# EAGLE design bits3.2 (EAGLE 9.2.2)
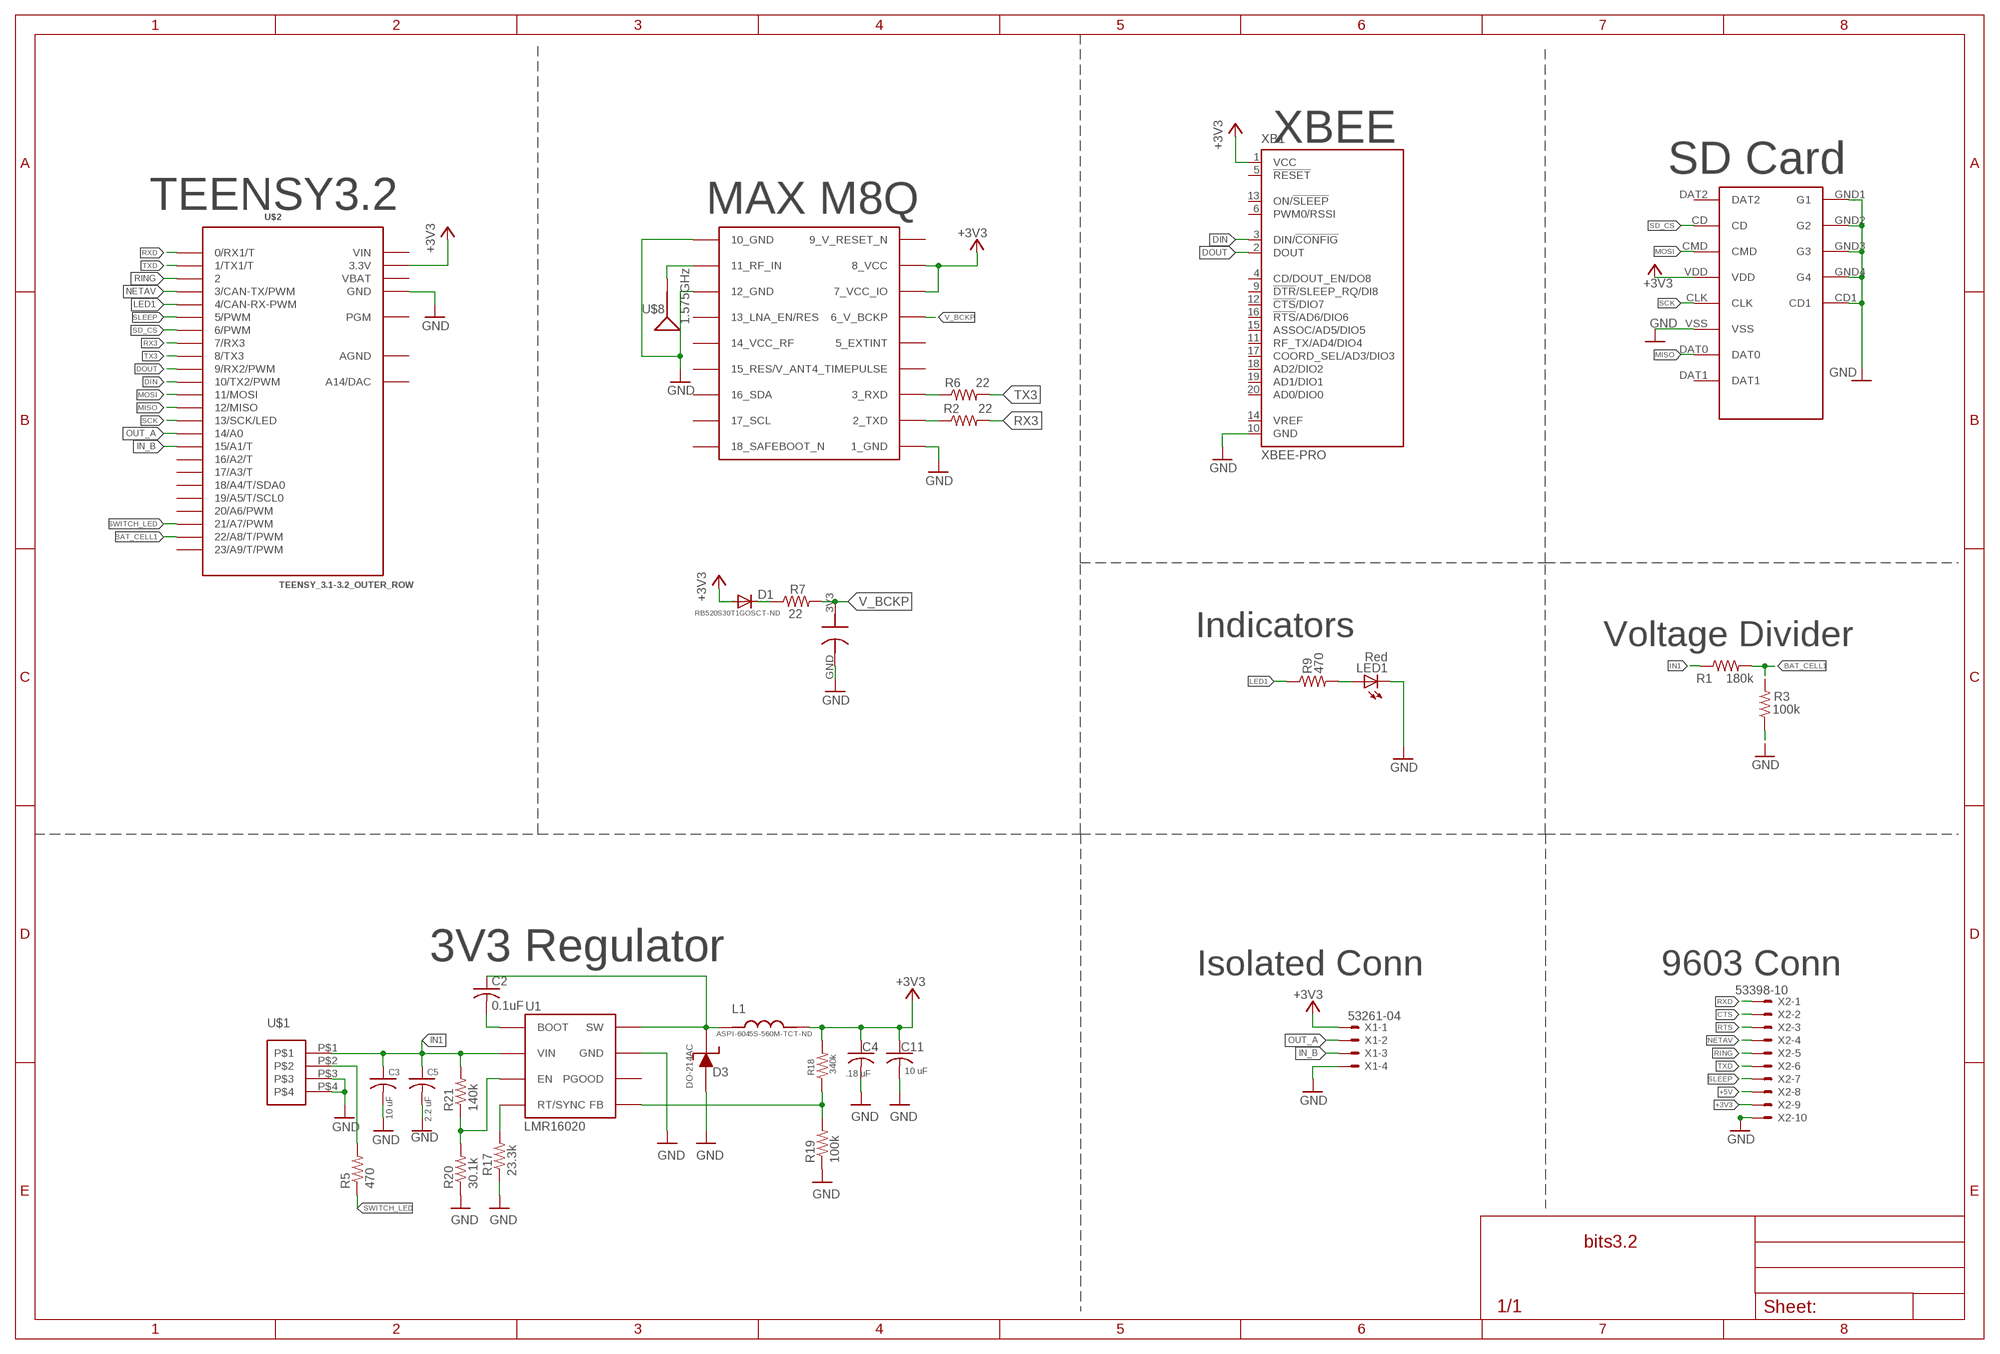
[diagram p0: schematic, sheet 1]

## Parts
C1  0.2F  DCK-3R3E204T614-E  [ELNASUPERCAP]
C2  0.1uF  C-USC0603  [C0603]
C3  10 uF  C-USC1210  [C1210]
C4  .18 uF  C-USC0603  [C0603]
C5  2.2 uF  C-USC1210  [C1210]
C11  10 uF  C-USC0603  [C0603]
D1  RB520S30T1GOSCT-ND  DIODE-SOD523  [SOD523]
D3  DO-214AC  [DO-214AC]
L1  ASPI-6045S-560M-TCT-ND  [ABRACON]
LED1  Red  LEDCHIP-LED0603  [CHIP-LED0603]
R1  180k  R-US_R0603  [R0603]
R2  22  R-US_R0603  [R0603]
R3  100k  R-US_R0603  [R0603]
R5  470  R-US_R0603  [R0603]
R6  22  R-US_R0603  [R0603]
R7  22  R-US_R0603  [R0603]
R9  470  R-US_R0603  [R0603]
R17  23.3k  R-US_R0603  [R0603]
R18  340k  R-US_R0603  [R0603]
R19  100k  R-US_R0603  [R0603]
R20  30.1k  R-US_R0603  [R0603]
R21  140k  R-US_R0603  [R0603]
U1  LMR16020  [SO8]
U$1  MICROCLASP_4  [4_PIN_MICROCLASP]
U$2  TEENSY_3.1-3.2_OUTER_ROW  [TEENSY_3.0-3.2&LC_OUTER_ROW]
U$4  MICRO_SD  [MICRO_SD_HINGED]
U$7  MAX-M8  [MAX-M8]
U$8  1.575GHz  SPARKFUN-GPS_ANTENNAGPS-2X7MM  [SPARKFUN-GPS_ANT-GPS-2X7MM]
X1  53261-04  [53261-04]
X2  53398-10  [53398-10]
XB1  XBEE-PRO  [XBEE-PRO]

## Nets
+3V3: C4.1 C11.1 D1.A L1.P$2 R18.2 U$2.3.3V U$2.3.3V1(3.3V) U$4.VDD U$7.7_VCC_IO U$7.8_VCC X1.1 X2.9 XB1.1(VCC)
+5V: X2.8
BAT_CELL1: R1.2 R3.2 U$2.22/A8(22/A8/T/PWM)
CTS: X2.2
DIN: U$2.10(10/TX2/PWM) XB1.3(DIN/!CONFIG)
DOUT: U$2.9(9/RX2/PWM) XB1.2(DOUT)
FB: R18.1 R19.2 U1.P$5(FB)
GND: C1.GND C3.2 C4.2 C5.2 C11.2 D3.P$1 LED1.C R3.1 R17.1 R19.1 R20.1 U1.P$7(GND) U1.PAD(GND) U$1.P$3 U$1.P$4 U$2.GND U$2.GND1(GND) U$4.CD1 U$4.GND1(G1) U$4.GND2(G2) U$4.GND3(G3) U$4.GND4(G4) U$4.VSS U$7.1_GND U$7.10_GND U$7.12_GND X1.4 X2.10 XB1.10(GND)
IN1: C3.1 C5.1 R1.1 R21.2 U1.P$2(VIN) U$1.P$1
IN_B: U$2.15/A1(15/A1/T) X1.3
LED1: R9.1 U$2.4(4/CAN-RX-PWM)
MISO: U$2.12(12/MISO) U$4.DAT0
MOSI: U$2.11(11/MOSI) U$4.CMD
N$1: U$7.11_RF_IN U$8.1(SIGNAL)
N$2: D1.C R7.1
N$3: R6.1 U$7.3_RXD
N$4: R2.1 U$7.2_TXD
N$6: LED1.A R9.2
N$7: R20.2 R21.1 U1.P$3(EN)
N$29: R17.2 U1.P$4(RT/SYNC)
N$31: C2.2 U1.P$1(BOOT)
N$33: R5.2 U$1.P$2
NETAV: U$2.3(3/CAN-TX/PWM) X2.4
OUT_A: U$2.14/A0 X1.2
RING: U$2.2 X2.5
RTS: X2.3
RX3: R2.2 U$2.7(7/RX3)
RXD: U$2.0(0/RX1/T) X2.1
SCK: U$2.13(13/SCK/LED) U$4.CLK
SD_CS: U$2.6(6/PWM) U$4.CD
SLEEP: U$2.5(5/PWM) X2.7
SW: C2.1 D3.P$2 L1.P$1 U1.P$8(SW)
SWITCH_LED: R5.1 U$2.21/A7(21/A7/PWM)
TX3: R6.2 U$2.8(8/TX3)
TXD: U$2.1(1/TX1/T) X2.6
V_BCKP: C1.3V3 R7.2 U$7.6_V_BCKP
Unconnected: U1.P$6(PGOOD) U$2.16/A2(16/A2/T) U$2.17/A3(17/A3/T) U$2.18/A4(18/A4/T/SDA0) U$2.19/A5(19/A5/T/SCL0) U$2.20/A6(20/A6/PWM) U$2.23/A9(23/A9/T/PWM) U$2.PGM U$2.RESET/DAC(A14/DAC) U$4.DAT1 U$4.DAT2 U$7.4_TIMEPULSE U$7.5_EXTINT U$7.13_LNA_EN(13_LNA_EN/RES) U$7.14_VCC_RF U$7.15_V_ANT/RESERVED(15_RES/V_ANT) U$7.16_SDA U$7.17_SCL U$7.18_SAFEBOOT_N XB1.4(CD/DOUT_EN/DO8) XB1.5(!RESET) XB1.6(PWM0/RSSI) XB1.9(!DTR!/SLEEP_RQ/DI8) XB1.11(RF_TX/AD4/DIO4) XB1.12(!CTS!/DIO7) XB1.13(ON/!SLEEP) XB1.14(VREF) XB1.15(ASSOC/AD5/DIO5) XB1.16(!RTS!/AD6/DIO6) XB1.17(COORD_SEL/AD3/DIO3) XB1.18(AD2/DIO2) XB1.19(AD1/DIO1) XB1.20(AD0/DIO0)

## Notes on the sheet
- XBEE
- SD Card
- TEENSY3.2 | MAX M8Q
- Indicators | Voltage Divider
- 3V3 Regulator
- Isolated Conn | 9603 Conn

## Power pins joined to a net without a drawn wire
9_V_RESET_N: U$7.9_RESET_N(9_V_RESET_N)
AGND: U$2.AGND
VBAT: U$2.VBAT
VIN: U$2.VIN

## Library data of the parts
C1 = jmolterLib:DCK-3R3E204T614-E: ELNA Supercapacitor 3.3V max DCK-3R3E204T614-E 0.2F DCK-3R3E404T614-E 0.4F
C2-C5 C11 = resistor:C-US: CAPACITOR, American symbol
D1 = diode:DIODE-: DIODE
D3 = HASP:DO-214AC
L1 = inductors:ASPI-6045S-560M-TCT-ND
LED1 = led:LED: LED OSRAM: - CHIPLED LG R971, LG N971, LY N971, LG Q971, LY Q971, LO R971, LY R971 LH N974, LH R974 LS Q976, LO Q976, LY Q976 LO Q996 - Hyper CHIPLED LW Q18S LB Q993, LB Q99A, LB R99A - SideLED LS A670, LO A670, LY A670, LG A670, LP A670 LB A673, LV A673, LT A673, LW A673 LH A674 LY A675 LS A676, LA A676, LO A676, LY A676, LW A676 LS A679, LY A679, LG A679 - Hyper Micro SIDELED® LS Y876, LA Y876, LO Y876, LY Y876 LT Y87S - SmartLED LW L88C, LW L88S LB L89C, LB L89S, LG L890 LS L89K, LO L89K, LY L89K LS L896, LA L896, LO L896, LY L896 - TOPLED LS T670, LO T670, LY T670, LG T670, LP T670 LSG T670, LSP T670, LSY T670, LOP T670, LYG T670 LG T671, LOG T671, LSG T671 LB T673, LV T673, LT T673, LW T673 LH T674 LS T676, LA T676, LO T676, LY T676, LB T676, LH T676, LSB T676, LW T676 LB T67C, LV T67C, LT T67C, LS T67K, LO T67K, LY T67K, LW E67C LS E67B, LA E67B, LO E67B, LY E67B, LB E67C, LV E67C, LT E67C LW T67C LS T679, LY T679, LG T679 LS T770, LO T770, LY T770, LG T770, LP T770 LB T773, LV T773, LT T773, LW T773 LH T774 LS E675, LA E675, LY E675, LS T675 LS T776, LA T776, LO T776, LY T776, LB T776 LHGB T686 LT T68C, LB T68C - Hyper Mini TOPLED® LB M676 - Mini TOPLED Santana® LG M470 LS M47K, LO M47K, LY M47K Source: http://www.osram.convergy.de LUXEON: - LUMILED® LXK2-PW12-R00, LXK2-PW12-S00, LXK2-PW14-U00, LXK2-PW14-V00 LXK2-PM12-R00, LXK2-PM12-S00, LXK2-PM14-U00 LXK2-PE12-Q00, LXK2-PE12-R00, LXK2-PE12-S00, LXK2-PE14-T00, LXK2-PE14-U00 LXK2-PB12-K00, LXK2-PB12-L00, LXK2-PB12-M00, LXK2-PB14-N00, LXK2-PB14-P00, LXK2-PB14-Q00 LXK2-PR12-L00, LXK2-PR12-M00, LXK2-PR14-Q00, LXK2-PR14-R00 LXK2-PD12-Q00, LXK2-PD12-R00, LXK2-PD12-S00 LXK2-PH12-R00, LXK2-PH12-S00 LXK2-PL12-P00, LXK2-PL12-Q00, LXK2-PL12-R00 Source: www.luxeon.com KINGBRIGHT: KA-3528ASYC Source: www.kingbright.com
R1 R3 R5 R9 R17-R21 = resistor:R-US_: RESISTOR, American symbol
R2 R6 R7 = rcl:R-US_: RESISTOR, American symbol; SPICEPREFIX: R
U1 = HASP:LMR16020
U$1 = NR_connectors:MICROCLASP_4
U$2 = Teensy_3_and_LC_Series_Boards_v1.4:TEENSY_3.1-3.2_OUTER_ROW: Footprint for Teensy 3.1 or 3.2 board using all pin connections on the outer perimeter
U$4 = NR_connectors:MICRO_SD
U$7 = ubloxLib:MAX-M8: u-blox MAX GNSS module
U$8 = Tracksoar v2 :SPARKFUN-GPS_ANTENNA: Single-ended Antennae 1.575GHz antennae with just one terminal. These are all chip antennae. 1575MHz (GPS) Antennae ANT-GPS-2X7MM - 2.0 x 7.0 mm chip antenna. (SparkFun Product <https://www.sparkfun.com/products/9131>) ANT-GPS-2X8MM - 2.0 x 8.0 mm chip antenna. (SparkFun Product <https://www.sparkfun.com/products/8418>); PROD_ID: ANT-09087; SF_ID: GPS-09131
X1 = con-molex:53?-04: CONNECTOR wire to board 1.25 mm (.049 inch) pitch header; MF: MOLEX; OC_FARNELL: 1125374; OC_NEWARK: unknown
X2 = con-molex:53?-10: CONNECTOR wire to board 1.25 mm (.049 inch) pitch header; MF: MOLEX; MPN: 53398-1071; OC_FARNELL: unknown; OC_NEWARK: 59J0425
XB1 = maxstream:XBEE: XBee (TM) /XBee-PRO(TM) OEM RF Modules Source: MaxStream, Inc. xbee_productmanual.pdf

## Board
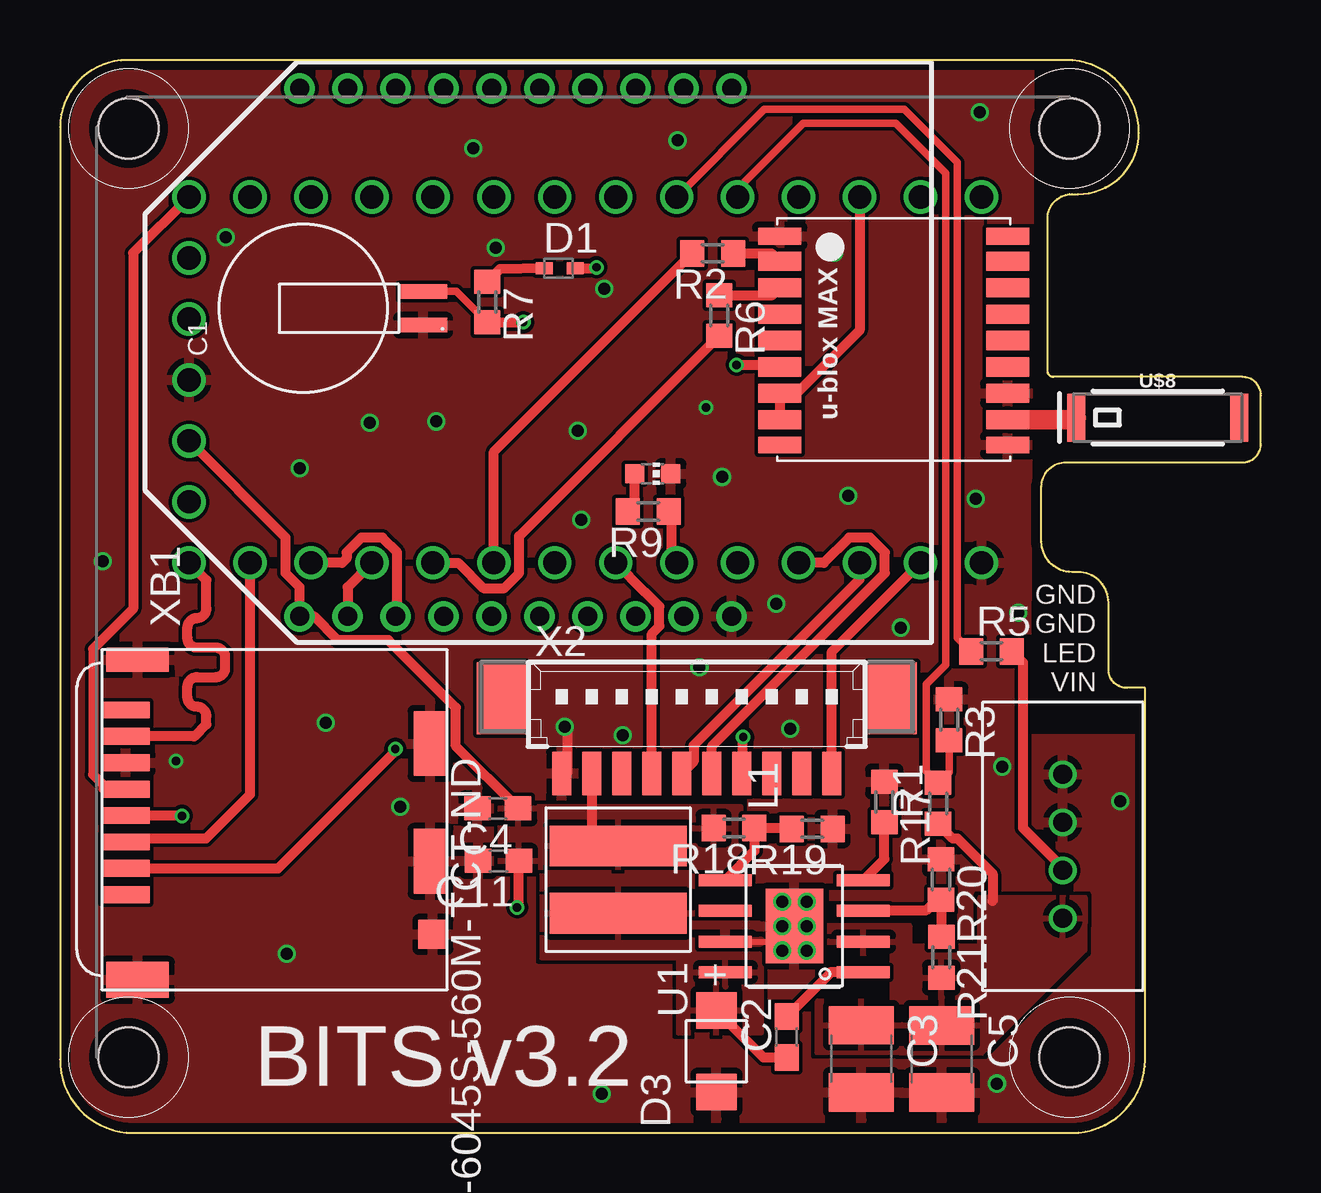
[diagram p1: board, top side]
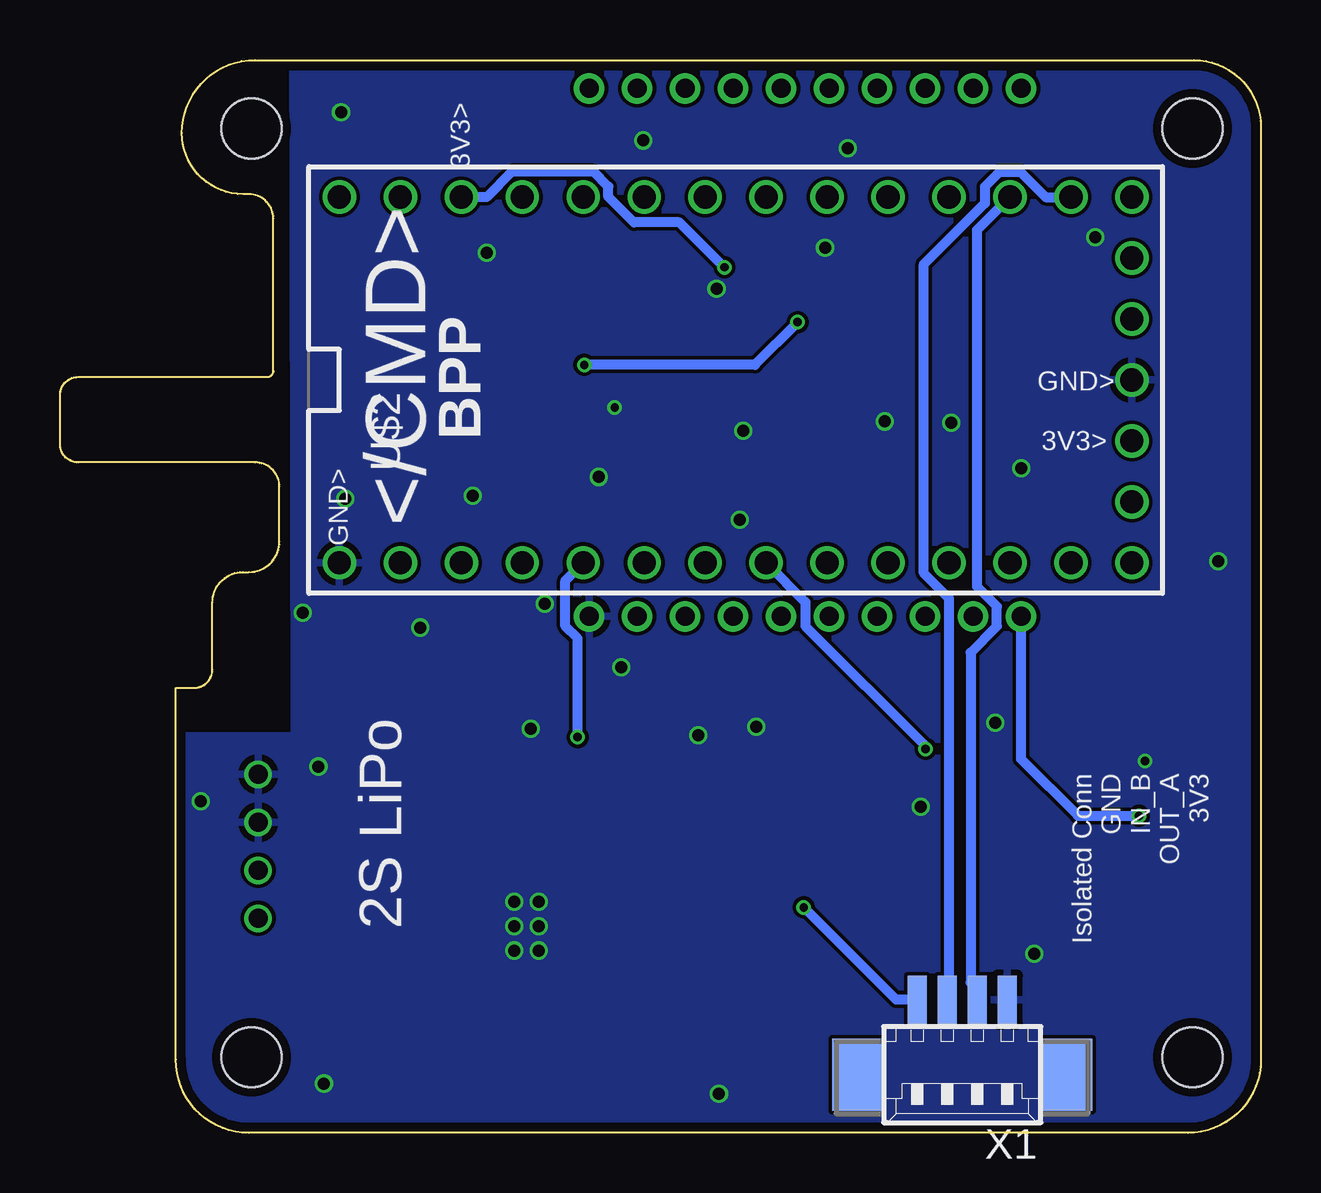
[diagram p2: board, bottom side, seen from below]

Size 50.04 x 44.7 mm. Coordinates in mm from the lower left corner, seen from the top.
Outline: 3.05,0 42.16,0 arc90 45.21,3.05 45.21,18.54 44.45,18.54 arc-90 43.69,19.3 43.69,22.1 arc90 42.42,23.37 42.16,23.37 arc-90 40.89,24.64 40.89,26.92 arc-90 41.91,27.94 49.28,27.94 arc90 50.04,28.7 50.04,30.73 arc90 49.28,31.5 41.4,31.5 arc-90 41.15,31.75 41.15,38.1 arc-90 42.16,39.12 42.42,39.12 arc90 44.96,41.66 arc90 41.91,44.7 2.79,44.7 arc90 0,41.91 0,3.05 arc90 3.05,0
Copper layers (1*16): Top 0.035559375mm / dielectric 1.6mm / Bottom 0.035559375mm
Design rules "oshpark-2layer *": minimum track width 6mil, minimum drill 10mil, track to track 6mil, track to pad 6mil, pad to pad 6mil, via to via 6mil, smd to smd 6mil, copper to edge 15mil, drill to drill 6mil, minimum pad ring 5mil, minimum via ring 5mil, stop-mask expansion 2.5mil, vias tented up to drill 0mil, thermal gap 10mil
Holes 2.5 mm at 42.06,3.15 2.85,3.15 42.06,41.85 2.85,41.85

### Footprints (pad centres in the part's own frame; a part is rotated, then mirrored left to right if it is on the bottom)
ELNASUPERCAP = smd 0.6 x 2: 3V3 0.7,-1.5; GND -0.7,-1.5
C0603 = smd 1.1 x 1: 1 -0.85,0; 2 0.85,0
C1210 = smd 1.6 x 2.7: 1 -1.4,0; 2 1.4,0
SOD523 = smd 0.7 x 0.5: A 0.7,0; C -0.6,0
DO-214AC = smd 1.524 x 1.676: P$1 -1.702,0; P$2 1.702,0
ABRACON = smd 1.7 x 5.7: P$1 1.4,0; P$2 -1.4,0
CHIP-LED0603 = smd 0.8 x 0.8: A 0,-0.75; C 0,0.75
R0603 = smd 1 x 1.1: 1 -0.85,0; 2 0.85,0
SO8 = smd 0.5 x 2.2: P$1 -1.92,-2.875; P$2 -0.65,-2.875; P$3 0.65,-2.875; P$4 1.92,-2.875; P$5 1.92,2.875; P$6 0.65,2.875; P$7 -0.65,2.875; P$8 -1.92,2.875 | smd 3.1 x 2.4: PAD 0,0
4_PIN_MICROCLASP = drill 0.8: P$1 -3,0; P$2 -1,0; P$3 1,0; P$4 3,0
TEENSY_3.0-3.2&LC_OUTER_ROW = drill 0.965: 0 -7.62,13.97; 1 -7.62,11.43; 2 -7.62,8.89; 3 -7.62,6.35; 3.3V 7.62,11.43; 3.3V1 -2.54,-16.51; 4 -7.62,3.81; 5 -7.62,1.27; 6 -7.62,-1.27; 7 -7.62,-3.81; 8 -7.62,-6.35; 9 -7.62,-8.89; 10 -7.62,-11.43; 11 -7.62,-13.97; 12 -7.62,-16.51; 13 7.62,-16.51; 14/A0 7.62,-13.97; 15/A1 7.62,-11.43; 16/A2 7.62,-8.89; 17/A3 7.62,-6.35; 18/A4 7.62,-3.81; 19/A5 7.62,-1.27; 20/A6 7.62,1.27; 21/A7 7.62,3.81; 22/A8 7.62,6.35; 23/A9 7.62,8.89; AGND 7.62,13.97; GND -7.62,16.51; GND1 0,-16.51; PGM 2.54,-16.51; RESET/DAC 5.08,-16.51; VBAT -5.08,-16.51; VIN 7.62,16.51
MICRO_SD_HINGED = smd 0.7 x 2: CD -1.1,-13.4; CLK -4.4,-13.4; CMD -2.2,-13.4; DAT0 -6.6,-13.4; DAT1 -7.7,-13.4; DAT2 0,-13.4; VDD -3.3,-13.4; VSS -5.5,-13.4 | smd 2.7 x 1.4: CD1 -1.4,-0.7; GND3 -6.3,-0.7 | smd 1.5 x 2.6: GND1 3.55,-12.9 | smd 1.2 x 1.2: GND2 1.65,-0.6 | smd 1 x 2.6: GND4 -9.8,-12.9
MAX-M8 = smd 1.8 x 0.7: 1_GND 4.95,-4.4; 9_RESET_N 4.95,4.3; 10_GND -4.55,4.3; 18_SAFEBOOT_N -4.55,-4.4 | smd 1.8 x 0.8: 2_TXD 4.95,-3.35; 3_RXD 4.95,-2.25; 4_TIMEPULSE 4.95,-1.15; 5_EXTINT 4.95,-0.05; 6_V_BCKP 4.95,1.05; 7_VCC_IO 4.95,2.15; 8_VCC 4.95,3.25; 11_RF_IN -4.55,3.25; 12_GND -4.55,2.15; 13_LNA_EN -4.55,1.05; 14_VCC_RF -4.55,-0.05; 15_V_ANT/RESERVED -4.55,-1.15; 16_SDA -4.55,-2.25; 17_SCL -4.55,-3.35
SPARKFUN-GPS_ANT-GPS-2X7MM = smd 0.75 x 2: 1 -3.4,0; NC 3.4,0
53261-04 = smd 0.8 x 2: 1 1.875,-2.5; 2 0.625,-2.5; 3 -0.625,-2.5; 4 -1.875,-2.5 | smd 2.1 x 3: S1 4.375,0.625; S2 -4.375,0.625
53398-10 = smd 0.8 x 1.8: 1 5.625,-2.5; 2 4.375,-2.5; 3 3.125,-2.5; 4 1.875,-2.5; 5 0.625,-2.5; 6 -0.625,-2.5; 7 -1.875,-2.5; 8 -3.125,-2.5; 9 -4.375,-2.5; 10 -5.625,-2.5 | smd 2.1 x 3: S1 8.125,0.625; S2 -8.125,0.625
XBEE-PRO = drill 0.8 pad 1.27: 1 -11,9; 2 -11,7; 3 -11,5; 4 -11,3; 5 -11,1; 6 -11,-1; 7 -11,-3; 8 -11,-5; 9 -11,-7; 10 -11,-9; 11 11,-9; 12 11,-7; 13 11,-5; 14 11,-3; 15 11,-1; 16 11,1; 17 11,3; 18 11,5; 19 11,7; 20 11,9

### Placement (x,y rotation side)
C1  13.63,34.36 90 top
C2  30.28,4 90 top
C3  33.39,3.09 270 top
C4  18.24,13.52 180 top
C5  36.74,3.08 270 top
C11  18.27,11.33 180 top
D1  20.77,36.03 0 top
D3  27.35,3.4 90 top
L1  23.26,10.56 270 top
LED1  24.7,27.46 270 top
R1  36.59,13.73 90 top
R2  27.2,36.65 180 top
R3  37.05,17.21 270 top
R5  38.81,20.07 0 top
R6  27.47,34.06 270 top
R7  17.8,34.62 270 top
R9  24.51,25.89 180 top
R17  34.35,13.79 270 top
R18  28.09,12.7 180 top
R19  31.34,12.67 180 top
R20  36.71,10.56 270 top
R21  36.72,7.32 270 top
U1  30.6,8.62 90 top
U$1  41.78,11.94 90 top
U$2  21.89,31.37 90 bottom
U$4  16.14,9.92 270 top
U$7  34.94,32.97 180 top
U$8  45.74,29.8 0 top
X1  12.45,3.05 180 bottom
X2  26.53,17.48 0 top
XB1  18.99,32.52 90 top

### Tracks (layer width: path | path; a pad name or v marks a point on that pad's centre or on a via)
+3V3  (via drill 0.35)
  Top 0.406: C4.1 16.49,16.11 16.49,17.72 13.68,20.53 11.58,20.53 10.59,21.52 XB1.1 9.99,22.74 9.4,23.32 9.4,24.8 U$2.3.3V1 | v5.08,13.21 2.75,13.21 U$4.VDD | U$2.3.3V 33.32,33.44 30.69,30.82 U$7.7_VCC_IO U$7.8_VCC | D1.A 22.31,36.03 v22.35,36.07 | v19.05,9.4 19.12,9.47 C11.1 | X2.9 22.16,12 22.12,11.96 | 22.1,11.94 22.12,11.96 | 22.12,11.96 L1.P$2
  Bottom 0.406: v5.08,13.21 7.62,13.21 9.99,15.57 XB1.1 | v22.35,36.07 24.23,37.94 26.13,37.94 27.18,39 27.18,39.43 27.8,40.04 31.21,40.04 32.26,38.99 U$2.3.3V | X1.1 15.2,5.55 v19.05,9.4
  pour Top: 18.36,10.64 18.36,13.59 28.35,13.59 28.35,11.07 19.68,11.07 19.68,10.64
BAT_CELL1
  Top 0.305: U$2.22/A8 28.24,39.34 30.96,42.06 34.82,42.06 36.91,39.98 36.91,19.51 36.09,18.69 36.09,15.08 R1.2 37.05,15.04 R3.2
DIN
  Top 0.406: U$2.10 11.76,23.75 11.94,23.94 11.94,24.19 12.56,24.8 13.43,24.8 14.05,24.19 14.05,21.59 XB1.3
DOUT
  Top 0.406: U$2.9 11.99,22.74 XB1.2
FB
  Top 0.406: R19.2 30.46,12.7 R18.1 28.94,11.75 U1.P$5
GND  (via drill 0.35, 0.5)
  Top 0.254: U1.P$7 29.73,7.97 v30.09,7.6
  Top 0.406: v21.03,16.92 21.13,16.81 21.13,14.98 X2.10
  other vias: 9.45,7.47 11.07,17.09 9.98,27.69 1.78,23.83 6.91,37.31 17.22,41.02 18.16,36.88 22.68,35.18 15.67,29.64 21.72,25.55 27.58,27.33 21.56,29.26 38.15,26.42 32.26,36.68 32.84,26.54 29.84,22.05 26.64,19.41 23.44,16.56 30.43,16.84 35.03,21.06 39.04,2.06 44.17,13.82 39.93,21.67 25.73,41.35 30.09,8.62 30.09,9.63 31.11,7.6 31.11,8.62 31.11,9.63 39.27,15.27 4.83,15.49 26.92,30.23 38.33,42.52 22.58,1.63 12.9,29.59 14.17,13.59
  pour Top (rank 6): -0.4,-0.85 -0.4,47.15 40.41,47 40.23,16.43 46.6,16.43 46.6,-1
  pour Bottom (rank 6): -0.55,-2 -0.55,48 40.35,47.73 40.28,16.56 48.44,16.56 48.44,-2
IN1
  Top 0.406: 38.86,9.65 38.86,10.81 37.41,12.26 37.21,12.26 R1.1
  pour Top: 32,7.49 32,8.64 35.38,8.64 35.38,7.77 38.35,7.77 38.35,9.8 42.7,9.8 42.68,7.63 38.37,3.31 31.57,3.35 31.57,5.49 34.7,5.49 34.7,7.49
IN_B
  Bottom 0.406: U$2.15/A1 11.82,37.63 11.82,22.76 11,21.94 11,21.12 12.1,20.01 12.1,6.26 11.82,5.98 X1.3
LED1
  Top 0.305: 25.49,25.8 R9.1
  Top 0.406: U$2.4 25.49,23.95 25.49,25.8
MISO
  Top 0.406: U$2.12 6.1,23.03 6.1,21.84 arc-90 5.7,21.45 arc90 5.31,21.06 5.31,20.61 arc90 5.7,20.22 6.49,20.22 arc-90 6.88,19.83 6.88,19.38 arc-90 6.49,18.99 5.7,18.99 arc90 5.31,18.59 5.31,18.15 arc90 5.7,17.76 arc-90 6.1,17.36 6.1,17.02 5.59,16.51 5.58,16.52 U$4.DAT0
MOSI
  Top 0.406: U$4.CMD 2.88,12.26 6.08,12.26 7.92,14.1 U$2.11
N$1
  Top 0.813: U$7.11_RF_IN 42.25,29.72 U$8.1
N$2
  Top 0.406: D1.C 18.33,35.99 R7.1
N$3
  Top 0.406: R6.1 29.68,34.91 U$7.3_RXD
N$4
  Top 0.406: R2.1 29.65,36.65 U$7.2_TXD
N$6
  Top 0.406: R9.2 23.95,26.18 LED1.A
N$7
  Top 0.406: U1.P$3 36.07,9.27 36.51,9.71 R20.2 R21.1
N$29
  Top 0.406: U1.P$4 34.35,11.41 R17.2
N$31
  Top 0.406: U1.P$1 32.13,6.7 C2.2
N$33
  Top 0.406: U$1.P$2 41.78,11.05 40.13,12.7 40.13,19.59 R5.2
NETAV  (via drill 0.35)
  Top 0.406: X2.4 28.45,15.02 28.45,16.47 v28.47,16.49
  Bottom 0.406: v28.47,16.49 28.47,20.6 28.98,21.12 28.98,23.01 U$2.3
OUT_A
  Bottom 0.406: X1.2 13,5.62 13,22.27 14.05,23.32 14.05,36.19 11.51,38.73 11.51,39.43 10.89,40.04 10.02,40.04 8.97,38.99 U$2.14/A0
RING
  Top 0.406: U$2.2 31.83,23.75 32.88,24.8 33.75,24.8 34.37,24.19 34.37,23.32 27.16,16.11 X2.5
RX3
  Top 0.406: U$2.7 18.08,28.37 R2.2
RXD
  Top 0.406: X2.1 32.16,20.05 U$2.0
SCK
  Top 0.305: 1.81,14.32 U$4.CLK
  Top 0.406: U$2.13 3.05,36.67 3.05,21.84 1.38,20.17 1.38,14.92 1.81,14.5 1.81,14.32
SD_CS  (via drill 0.35)
  Top 0.406: U$4.CD 9.09,11.02 13.97,15.9 v13.97,16
  Bottom 0.406: U$2.6 18.98,22.12 18.98,21.12 13.97,16.11 v13.97,16
SLEEP
  Top 0.406: X2.7 24.66,20.79 24.98,21.12 24.98,21.94 24.4,22.52 24.39,22.52 U$2.5
SW
  Top 0.406: D3.P$2 29.31,3.15 C2.1
  pour Top (rank 2): 29.18,7.06 29.18,7.42 26.42,7.42 26.42,10.85 20.09,10.85 20.09,7.32 25.78,7.32 25.78,4.19 29.21,4.19 29.21,7.06
SWITCH_LED
  Top 0.305: U$2.21/A7 29.35,42.65 35.18,42.65 37.39,40.44 37.39,20.64 R5.1
TX3
  Top 0.406: U$2.8 16.59,23.75 17.64,22.7 18.51,22.7 19.13,23.32 19.13,24.87 R6.2
TXD
  Top 0.406: U$2.1 33.32,23.06 26.4,16.14 26.4,15.47 X2.6
V_BCKP  (via drill 0.35)
  Top 0.305: C1.3V3 16.52,35.06 R7.2
  Top 0.406: R7.2 arc-90 17.81,33.78 v19.3,33.78 | v28.19,32 29.9,32 U$7.6_V_BCKP
  Bottom 0.406: v19.3,33.78 21.08,32 v28.19,32

### Text on the board
tPlace: GND / GND / LED / VIN | BITS v3.2
bPlace: 3V3> | </CMD> | BPP | GND> | 3V3> | GND> | 2S LiPo | Isolated Conn / GND / IN_B / OUT_A / 3V3